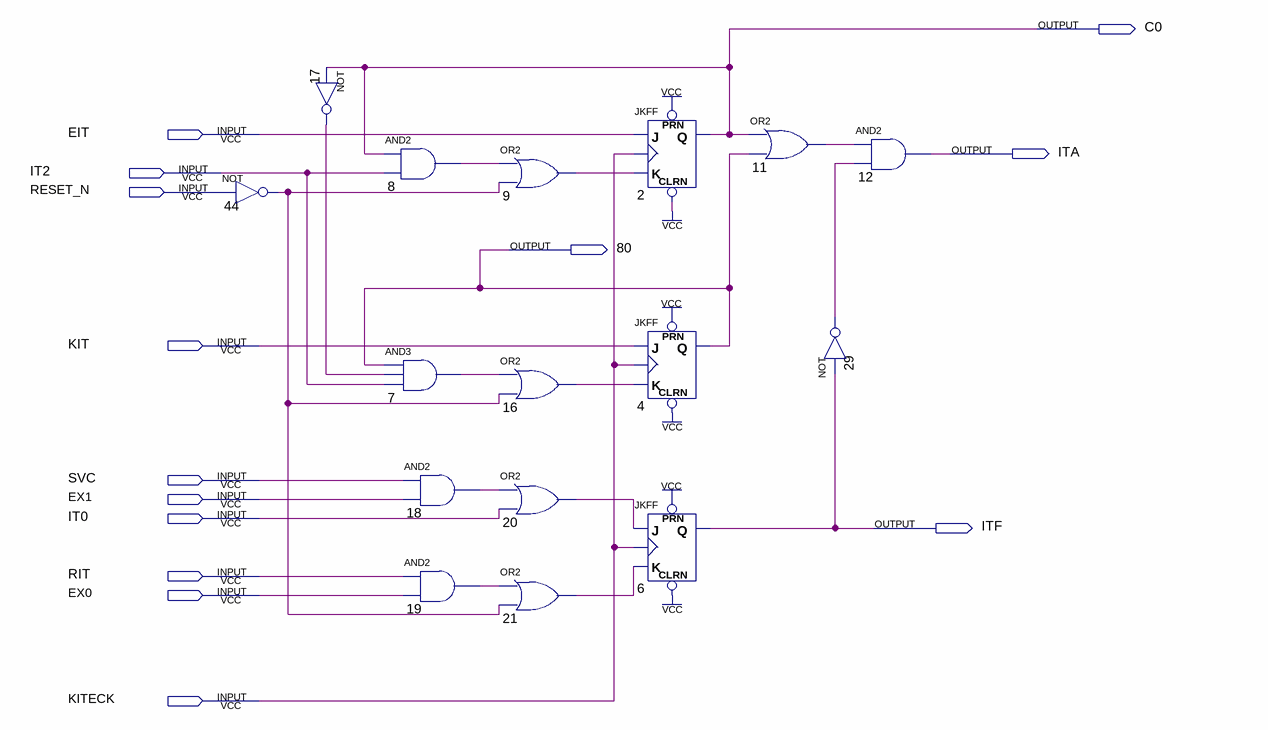
[diagram p0: schematic sheet]
// Quartus schematic itf.bdf as structural Verilog: 16 symbols, 14 pins
module itf (
  input  EIT,
  input  IT2,
  input  RESET_N,
  input  KIT,
  input  SVC,
  input  EX1,
  input  IT0,
  input  RIT,
  input  EX0,
  input  KITECK,
  output C0,
  output ITA,
  output \80 ,
  output ITF
);

  wire n7_out, n8_out, n9_out, n11_out, n16_out, n17_out, n18_out, n19_out, n20_out, n21_out, n29_out,
       n44_out;

  not u_44 (n44_out, RESET_N);
  not u_17 (n17_out, C0);
  and u_8 (n8_out, C0, IT2);
  and u_7 (n7_out, \80 , n17_out, IT2);
  and u_18 (n18_out, SVC, EX1);
  and u_19 (n19_out, RIT, EX0);
  or u_9 (n9_out, n8_out, n44_out);
  or u_16 (n16_out, n7_out, n44_out);
  or u_20 (n20_out, n18_out, IT0);
  or u_21 (n21_out, n19_out, n44_out);
  JKFF u_2 (.PRN(1'b1), .CLRN(1'b1), .K(n9_out), .J(EIT), .CLK(KITECK), .Q(C0));
  JKFF u_4 (.PRN(1'b1), .CLRN(1'b1), .K(n16_out), .J(KIT), .CLK(KITECK), .Q(\80 ));
  JKFF u_6 (.PRN(1'b1), .CLRN(1'b1), .K(n21_out), .J(n20_out), .CLK(KITECK), .Q(ITF));
  or u_11 (n11_out, C0, \80 );
  and u_12 (ITA, n11_out, n29_out);
  not u_29 (n29_out, ITF);
endmodule
